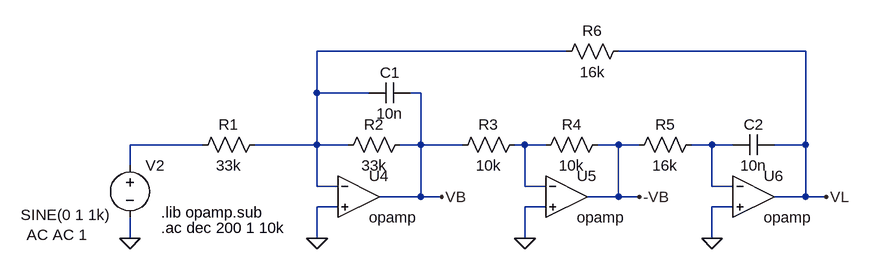
[diagram p0: schematic Biquad.asc]
Biquad.asc, the LTspice schematic file:
Version 4
SHEET 1 1688 680
WIRE 368 -128 -16 -128
WIRE 736 -128 448 -128
WIRE -16 -64 -16 -128
WIRE 64 -64 -16 -64
WIRE 144 -64 128 -64
WIRE -192 16 -304 16
WIRE -16 16 -16 -64
WIRE -16 16 -112 16
WIRE 32 16 -16 16
WIRE 144 16 144 -64
WIRE 144 16 112 16
WIRE 208 16 144 16
WIRE 304 16 288 16
WIRE 336 16 304 16
WIRE 448 16 416 16
WIRE 480 16 448 16
WIRE 592 16 560 16
WIRE 624 16 592 16
WIRE 736 16 736 -128
WIRE 736 16 688 16
WIRE -304 48 -304 16
WIRE -16 80 -16 16
WIRE 16 80 -16 80
WIRE 304 80 304 16
WIRE 336 80 304 80
WIRE 592 80 592 16
WIRE 624 80 592 80
WIRE 144 96 144 16
WIRE 144 96 80 96
WIRE 176 96 144 96
WIRE 448 96 448 16
WIRE 448 96 400 96
WIRE 480 96 448 96
WIRE 736 96 736 16
WIRE 736 96 688 96
WIRE 768 96 736 96
WIRE 16 112 -16 112
WIRE 336 112 304 112
WIRE 624 112 592 112
WIRE -304 160 -304 128
WIRE -16 160 -16 112
WIRE 304 160 304 112
WIRE 592 160 592 112
FLAG 304 160 0
FLAG 592 160 0
FLAG -304 160 0
FLAG -16 160 0
FLAG 176 96 VB
FLAG 480 96 -VB
FLAG 768 96 VL
SYMBOL res 128 0 R90
WINDOW 0 0 56 VBottom 2
WINDOW 3 32 56 VTop 2
SYMATTR InstName R2
SYMATTR Value 33k
SYMBOL res 576 0 R90
WINDOW 0 0 56 VBottom 2
WINDOW 3 32 56 VTop 2
SYMATTR InstName R5
SYMATTR Value 16k
SYMBOL res 304 0 R90
WINDOW 0 0 56 VBottom 2
WINDOW 3 32 56 VTop 2
SYMATTR InstName R3
SYMATTR Value 10k
SYMBOL cap 688 0 R90
WINDOW 0 0 32 VBottom 2
WINDOW 3 32 32 VTop 2
SYMATTR InstName C2
SYMATTR Value 10n
SYMBOL res 464 -144 R90
WINDOW 0 0 56 VBottom 2
WINDOW 3 32 56 VTop 2
SYMATTR InstName R6
SYMATTR Value 16k
SYMBOL OpAmps\\opamp 48 32 R0
SYMATTR InstName U4
SYMBOL OpAmps\\opamp 368 32 R0
SYMATTR InstName U5
SYMBOL OpAmps\\opamp 656 32 R0
SYMATTR InstName U6
SYMBOL voltage -304 32 R0
WINDOW 3 -168 92 Left 2
WINDOW 123 -159 123 Left 2
WINDOW 39 0 0 Left 0
SYMATTR Value SINE(0 1 1k)
SYMATTR Value2 AC AC 1
SYMATTR InstName V2
SYMBOL cap 128 -80 R90
WINDOW 0 0 32 VBottom 2
WINDOW 3 32 32 VTop 2
SYMATTR InstName C1
SYMATTR Value 10n
SYMBOL res 432 0 R90
WINDOW 0 0 56 VBottom 2
WINDOW 3 32 56 VTop 2
SYMATTR InstName R4
SYMATTR Value 10k
SYMBOL res -96 0 R90
WINDOW 0 0 56 VBottom 2
WINDOW 3 32 56 VTop 2
SYMATTR InstName R1
SYMATTR Value 33k
TEXT -256 144 Left 2 !.ac dec 200 1 10k
TEXT -256 120 Left 2 !.lib opamp.sub

The netlist it stands for:
* Biquad.asc
R2 VB N001 33k
R5 N004 -VB 16k
R3 N003 VB 10k
C2 VL N004 10n
R6 VL N001 16k
XU4 N001 0 VB opamp Aol=100K GBW=10Meg  ; pins invin noninvin out
XU5 N003 0 -VB opamp Aol=100K GBW=10Meg  ; pins invin noninvin out
XU6 N004 0 VL opamp Aol=100K GBW=10Meg  ; pins invin noninvin out
V2 N002 0 SINE(0 1 1k) AC AC 1
C1 VB N001 10n
R4 -VB N003 10k
R1 N001 N002 33k
.ac dec 200 1 10k
.lib opamp.sub
.backanno
.end

* Results of the author's LTspice run, read from the files saved beside the schematic
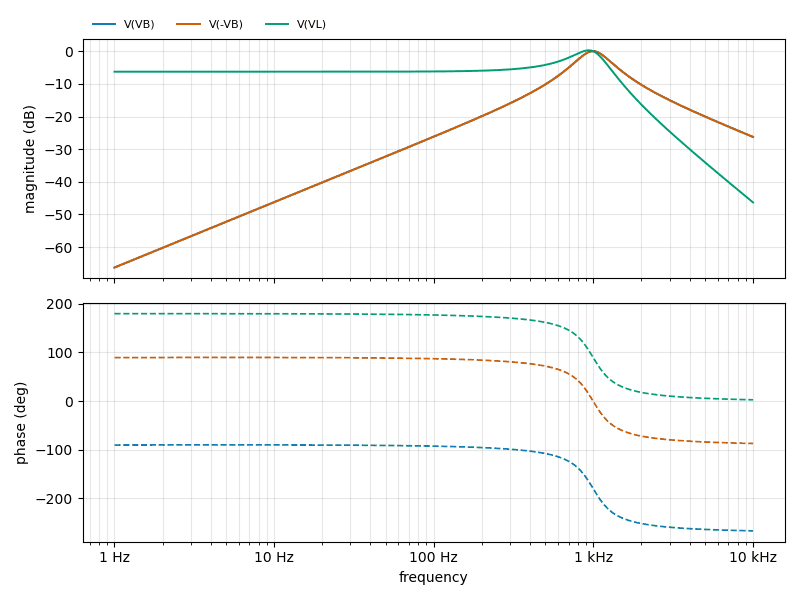
[diagram p1: AC Analysis of Biquad.asc, plotted from the saved traces]
* AC Analysis, 1 run:
*   V(VB): -66.24 dB at 1 Hz, -26.26 dB at 10 kHz, peak 0.00 dB at 1 kHz, 3 dB below the peak at 782.3 Hz and 1.264 kHz
*   V(-VB): -66.24 dB at 1 Hz, -26.26 dB at 10 kHz, peak 0.00 dB at 1 kHz, 3 dB below the peak at 782.3 Hz and 1.264 kHz
*   V(VL): -6.29 dB at 1 Hz, -46.31 dB at 10 kHz, peak 0.27 dB at 933.3 Hz, 3 dB below the peak at 638.8 Hz and 1.157 kHz